# Altium project OksLab_CanToUsb_HW01.PrjPcb
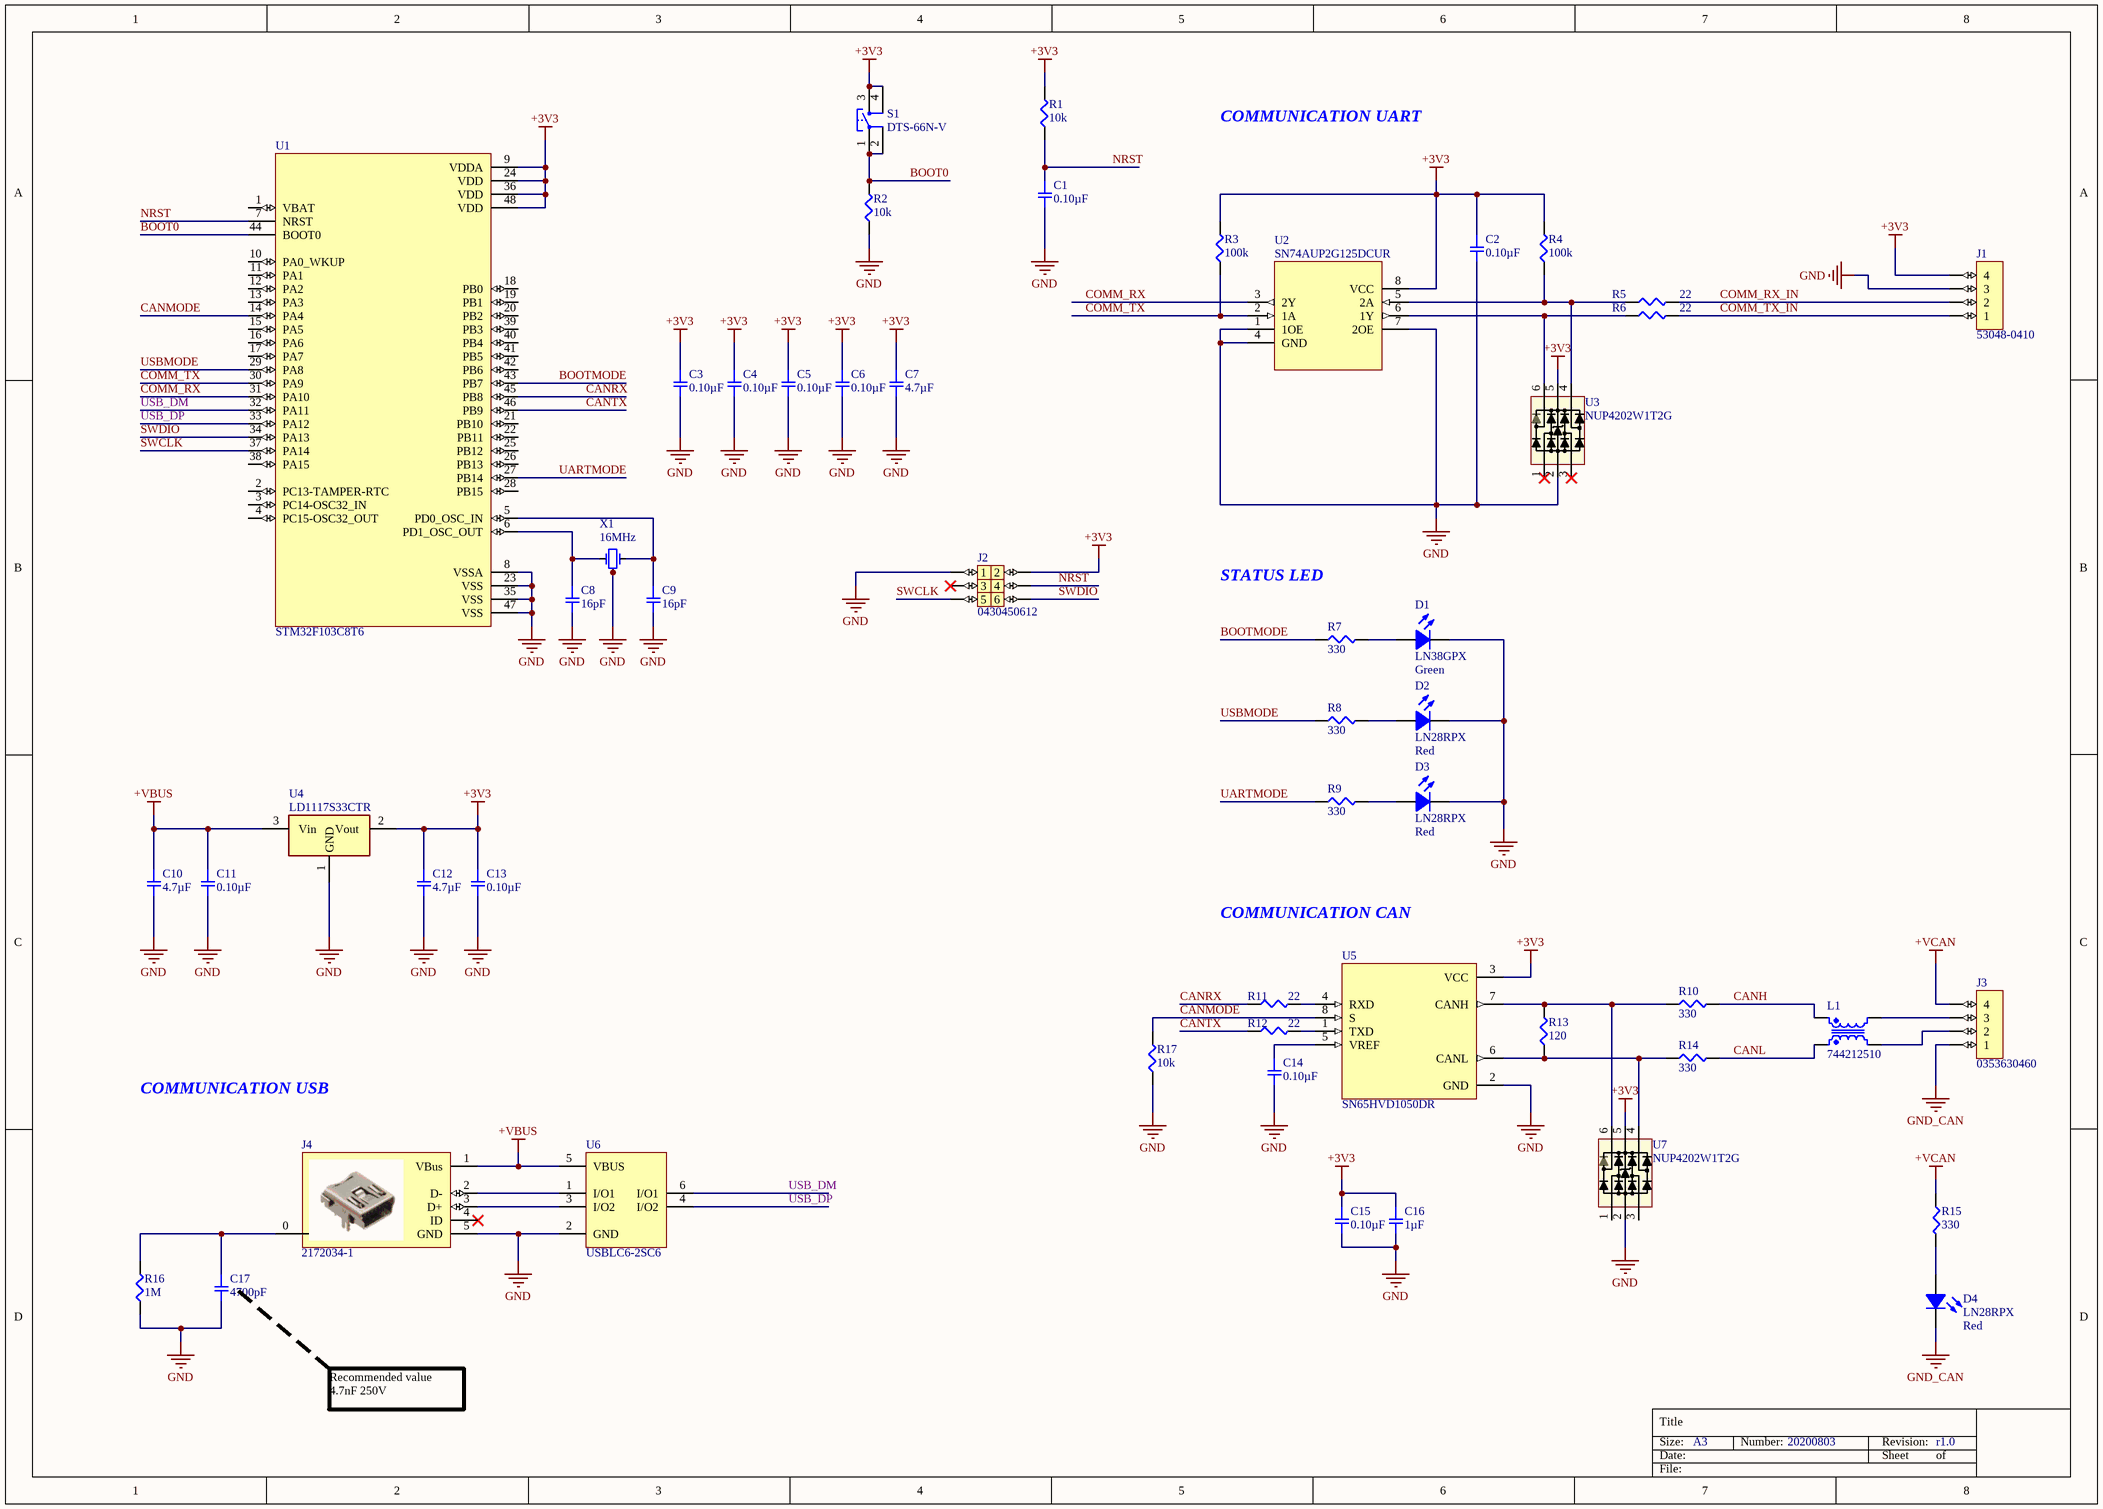
[diagram p0: OksLab_CanToUsb_HW01.SchDoc]
1 sheet, 52 parts. Net scope: global (net labels, ports and power ports of the same name join across sheets).
Board file: OksLab_CanToUsb_HW01.PcbDoc

## Sheet OksLab_CanToUsb_HW01.SchDoc
size A3; CompanyName: sinapstek; Engineer: yakdagg; SheetNumber: 1; SheetTotal: 1; UniqueID: 20200803; X1: OksLab_CanToUsb_HW01.PrjPcb; X2: A3; X3: 20200803; X4: r1.0; X6: 1; X7: 1; X8: OksLab_CanToUsb_HW01.SchDoc

### Parts
C1  0.10µF  [SMD-0603C]
C2  0.10µF  [SMD-0603C]
C3  0.10µF  [SMD-0603C]
C4  0.10µF  [SMD-0603C]
C5  0.10µF  [SMD-0603C]
C6  0.10µF  [SMD-0603C]
C7  4.7µF  [SMD-0603C]
C8  16pF  [SMD-0603C]
C9  16pF  [SMD-0603C]
C10  4.7µF  [SMD-0603C]
C11  0.10µF  [SMD-0603C]
C12  4.7µF  [SMD-0603C]
C13  0.10µF  [SMD-0603C]
C14  0.10µF  [SMD-0603C]
C15  0.10µF  [SMD-0603C]
C16  1µF  [SMD-0603C]
C17  4700pF  [SMD-0805C]
D1  LN38GPX  Color: Green  [Led-3mm-Green-h7]
D2  LN28RPX  Lens Color: Red  [Led-3mm-Red-h7]
D3  LN28RPX  Lens Color: Red  [Led-3mm-Red-h7]
D4  LN28RPX  Lens Color: Red  [Led-3mm-Red-h7]
J1  53048-0410  [CONN_4_POS__0530480410]
J2  0430450612  [CONN_6_POS__0430450612]
J3  0353630460  [CONN_4_POS__0353630460]
J4  2172034-1  [USB_MINI__2172034-1]
L1  744212510  [CM_6.50mm x 3.60mm]
R1  10k  [SMD-0603-RES]
R2  10k  [SMD-0603-RES]
R3  100k  [SMD-0603-RES]
R4  100k  [SMD-0603-RES]
R5  22  [SMD-0603-RES]
R6  22  [SMD-0603-RES]
R7  330  [SMD-0603-RES]
R8  330  [SMD-0603-RES]
R9  330  [SMD-0603-RES]
R10  330  [SMD-0603-RES]
R11  22  [SMD-0603-RES]
R12  22  [SMD-0603-RES]
R13  120  [SMD-0603-RES]
R14  330  [SMD-0603-RES]
R15  330  [SMD-0603-RES]
R16  1M  [SMD-0603-RES]
R17  10k  [SMD-0603-RES]
S1  DTS-66N-V  [Tact_THD_6x6_13mm]
U1  STM32F103C8T6  [QFN48-(7mmX7mm)]
U2  SN74AUP2G125DCUR  [VFSOP_8]
U3  NUP4202W1T2G  [SOT-363]
U4  LD1117S33CTR  [SOT223-3N]
U5  SN65HVD1050DR  [SOIC-8_L]
U6  USBLC6-2SC6  [SOT23-6]
U7  NUP4202W1T2G  [SOT-363]
X1  Frequency: 16MHz  [XTAL_3.2mm_2.5mm_4pad]  (hidden comment: 7M-16.000MAAJ-T)

### Nets
+3V3: C2.1 C3.1 C4.1 C5.1 C6.1 C7.1 C12.1 C13.1 C15.1 C16.1 J1.4 J2.2 R1.2 R3.2 R4.2 S1.3 S1.4 U1.9(VDDA) U1.24(VDD) U1.36(VDD) U1.48(VDD) U2.8(VCC) U3.5 U4.2(Vout) U5.3(VCC) U7.5
+VBUS: C10.1 C11.1 J4.1(VBus) U4.3(Vin) U6.5(VBUS)
+VCAN: J3.4 R15.1
GND: C1.2 C2.2 C3.2 C4.2 C5.2 C6.2 C7.2 C8.2 C9.2 C10.2 C11.2 C12.2 C13.2 C14.2 C15.2 C16.2 C17.2 D1.2(K) D2.2(K) D3.2(K) J1.3 J2.1 J4.5(GND) R2.1 R16.1 R17.1 U1.8(VSSA) U1.23(VSS) U1.35(VSS) U1.47(VSS) U2.1(1OE) U2.4(GND) U2.7(2OE) U3.2 U4.1(GND) U5.2(GND) U6.2(GND) U7.2 X1.2(GND) X1.4(GND)
GND_CAN: D4.2(K) J3.1
BOOT0: R2.2 S1.1 S1.2 U1.44(BOOT0)
BOOTMODE: R7.1 U1.43(PB7)
CANH: L1.3 R10.2
CANL: L1.1 R14.2
CANMODE: R17.2 U1.14(PA4) U5.8(S)
CANRX: R11.1 U1.45(PB8)
CANTX: R12.1 U1.46(PB9)
COMM_RX: U1.31(PA10) U2.3(2Y)
COMM_RX_IN: J1.2 R5.2
COMM_TX: R3.1 U1.30(PA9) U2.2(1A)
COMM_TX_IN: J1.1 R6.2
NRST: C1.1 J2.4 R1.1 U1.7(NRST)
SWCLK: J2.5 U1.37(PA14)
SWDIO: J2.6 U1.34(PA13)
UARTMODE: R9.1 U1.27(PB14)
USB_DM: U1.32(PA11) U6.6(I/O1)
USB_DP: U1.33(PA12) U6.4(I/O2)
USBMODE: R8.1 U1.29(PA8)
NetC8_1: C8.1 U1.6(PD1_OSC_OUT) X1.1(OSC1)
NetC9_1: C9.1 U1.5(PD0_OSC_IN) X1.3(OSC2)
NetC14_1: C14.1 U5.5(VREF)
NetC17_1: C17.1 J4.0(Shield) R16.2
NetD1_1: D1.1(A) R7.2
NetD2_1: D2.1(A) R8.2
NetD3_1: D3.1(A) R9.2
NetD4_1: D4.1(A) R15.2
NetJ3_2: J3.2 L1.5
NetJ3_3: J3.3 L1.4
NetJ4_2: J4.2(D-) U6.1(I/O1)
NetJ4_3: J4.3(D+) U6.3(I/O2)
NetR4_1: R4.1 R5.1 U2.5(2A) U3.4
NetR6_1: R6.1 U2.6(1Y) U3.6
NetR10_1: R10.1 R13.2 U5.7(CANH) U7.6
NetR11_2: R11.2 U5.4(RXD)
NetR12_2: R12.2 U5.1(TXD)
NetR13_1: R13.1 R14.1 U5.6(CANL) U7.4

Not connected (* = marked no-connect by the designer): J2 3*; J4 4(ID)*; U1 1(VBAT) 2(PC13-TAMPER-RTC) 3(PC14-OSC32_IN) 4(PC15-OSC32_OUT) 10(PA0_WKUP) 11(PA1) 12(PA2) 13(PA3) 15(PA5) 16(PA6) 17(PA7) 18(PB0) 19(PB1) 20(PB2) 21(PB10) 22(PB11) 25(PB12) 26(PB13) 28(PB15) 38(PA15) 39(PB3) 40(PB4) 41(PB5) 42(PB6); U3 1* 3*; U7 1 3

### Notes on the sheet
- COMMUNICATION UART
- STATUS LED
- COMMUNICATION CAN
- COMMUNICATION USB
- Recommended value
  4.7nF 250V
- Title
- Size:
- Date:
- Number:
- Revision:
- Sheet
- of
- File:

### Library data of the parts
C1-C6 C11 C13-C15 = GCJ188R71H104KA12D: CAP CER 0.1UF 50V X7R 0603; Manufacturer: Murata Electronics North America; Factory Stock: 0; Unit Price (USD): 0.12; Minimum Quantity: 1; Tolerance: ±10%; Datasheets: http://www.murata.com/~/media/webrenewal/support/library/catalog/products/capacitor/mlcc/c03e.ashx; Image: //media.digikey.com/Renders/Murata%20Renders/0603%28LQG18%29.jpg; Digi-Key Part Number: 490-5798-1-ND; Quantity Available: 163695; @ qty: 0; Packaging: Cut Tape (CT); Series: GCJ; Part Status: Active; Value: 0.10µF; Voltage: 50V; Temperature Coefficient: X7R; Operating Temperature: -55°C ~ 125°C; Features: Soft Termination; Ratings: AEC-Q200; Applications: Automotive, Boardflex Sensitive; Mounting Type: Surface Mount, MLCC; Package / Case: 0603 (1608 Metric); Size / Dimension: 0.063" L x 0.031" W (1.60mm x 0.80mm); Height - Seated (Max): -; Thickness (Max): 0.035" (0.90mm); Lead Spacing: -; Lead Style: -
  C1 C3-C6 C11 C13-C15: Part Number: GCJ188R71H104KA12D
  C2: Manufacturer Part Number: GCJ188R71H104KA12D
C7 C10 C12 = GRM188R61C475KAAJD: CAP CER 4.7UF 16V X5R 0603; Manufacturer: Murata Electronics North America; Factory Stock: 0; Unit Price (USD): 0.3; Minimum Quantity: 1; Tolerance: ±10%; Datasheets: http://www.murata.com/~/media/webrenewal/support/library/catalog/products/capacitor/mlcc/c02e.pdf; Image: //media.digikey.com/Renders/Murata%20Renders/ZRB-SERIES-0402.jpg; Digi-Key Part Number: 490-10481-1-ND; Part Number: GRM188R61C475KAAJD; Quantity Available: 5977; @ qty: 0; Packaging: Cut Tape (CT); Series: GRM; Part Status: Active; Value: 4.7µF; Voltage: 16V; Temperature Coefficient: X5R; Operating Temperature: -55°C ~ 85°C; Features: Derating Recommended; Ratings: -; Applications: General Purpose; Mounting Type: Surface Mount, MLCC; Package / Case: 0603 (1608 Metric); Size / Dimension: 0.063" L x 0.031" W (1.60mm x 0.80mm); Height - Seated (Max): -; Thickness (Max): 0.037" (0.95mm); Lead Spacing: -; Lead Style: -
C8 C9 = GCM1885C1H160JA16D: CAP CER 16PF 50V NP0 0603; Manufacturer: Murata Electronics North America; Factory Stock: 0; Unit Price (USD): 0.11; Minimum Quantity: 1; Tolerance: ±5%; Temperature Coefficient: C0G, NP0; Datasheets: http://www.murata.com/~/media/webrenewal/support/library/catalog/products/capacitor/mlcc/c03e.ashx; Image: //media.digikey.com/Renders/Murata%20Renders/0603%28GCM188%29.jpg; Digi-Key Part Number: 490-8003-1-ND; Part Number: GCM1885C1H160JA16D; Quantity Available: 25223; @ qty: 0; Packaging: Cut Tape (CT); Series: GCM; Part Status: Active; Value: 16pF; Voltage: 50V; Operating Temperature: -55°C ~ 125°C; Features: -; Ratings: AEC-Q200; Applications: Automotive; Mounting Type: Surface Mount, MLCC; Package / Case: 0603 (1608 Metric); Size / Dimension: 0.063" L x 0.031" W (1.60mm x 0.80mm); Height - Seated (Max): -; Thickness (Max): 0.035" (0.90mm); Lead Spacing: -; Lead Style: -
C16 = GCM188R71C105KA64D: CAP CER 1UF 16V X7R 0603; Manufacturer: Murata Electronics North America; Factory Stock: 0; Unit Price (USD): 0.24; Minimum Quantity: 1; Tolerance: ±10%; Datasheets: http://www.murata.com/~/media/webrenewal/support/library/catalog/products/capacitor/mlcc/c03e.ashx; Image: //media.digikey.com/Renders/Murata%20Renders/0603%28GCM188%29.jpg; Digi-Key Part Number: 490-5241-1-ND; Part Number: GCM188R71C105KA64D; Quantity Available: 9243; @ qty: 0; Packaging: Cut Tape (CT); Series: GCM; Part Status: Active; Value: 1µF; Voltage: 16V; Temperature Coefficient: X7R; Operating Temperature: -55°C ~ 125°C; Features: -; Ratings: AEC-Q200; Applications: Automotive; Mounting Type: Surface Mount, MLCC; Package / Case: 0603 (1608 Metric); Size / Dimension: 0.063" L x 0.031" W (1.60mm x 0.80mm); Height - Seated (Max): -; Thickness (Max): 0.035" (0.90mm); Lead Spacing: -; Lead Style: -
C17 = GRM21AR72E472KW01D: CAP CER 4700PF 250V X7R 0805; Manufacturer: Murata Electronics North America; Factory Stock: 0; Unit Price (USD): 0.12; Minimum Quantity: 1; Tolerance: ±10%; Datasheets: http://www.murata.com/~/media/webrenewal/support/library/catalog/products/capacitor/mlcc/c02e.pdf; Image: //media.digikey.com/Renders/Murata%20Renders/0805%20(2012%20Metric)%20.85mm.jpg; Digi-Key Part Number: 490-3532-1-ND; Quantity Available: 18270; @ qty: 0; Packaging: Cut Tape (CT); Series: GRM; Part Status: Active; Value: 4700pF; Voltage: 250V; Temperature Coefficient: X7R; Operating Temperature: -55°C ~ 125°C; Features: -; Ratings: -; Applications: General Purpose; Mounting Type: Surface Mount, MLCC; Package / Case: 0805 (2012 Metric); Size / Dimension: 0.079" L x 0.049" W (2.00mm x 1.25mm); Height - Seated (Max): -; Thickness (Max): 0.039" (1.00mm); Lead Spacing: -; Lead Style: -; Manufacturer Part Number: GRM21AR72E472KW01D
D1 = LED_GREEN__LN38GPX: LED GREEN 3MM ROUND T/H; Manufacturer: Panasonic Electronic Components; Configuration: Standard; Millicandela Rating: 6mcd; Lens Style: Round with Domed Top; Lens Size: 3mm, T-1; Voltage - Forward (Vf) (Typ): 2.2V; Current - Test: 20mA; Wavelength - Peak: 565nm; Supplier 1: Digi-Key; Manufacturer Part Number: LN38GPX; RoHS: RoHS Compliant; Category: Optoelectronics; Stock 1: 0; Pricing 1: 1400=0 (USD); Packaging: Bulk; Part Status: Obsolete; Lens Color: -; Lens Transparency: -; Viewing Angle: -; Mounting Type: Through Hole; Wavelength - Dominant: -; Features: -; Package / Case: Radial; Supplier Device Package: Round Type; Size / Dimension: -; Height (Max): 5.70mm; Base Part Number: LN*8; ComponentLink1URL: https://media.digikey.com/pdf/Data%20Sheets/Panasonic%20LEDs%20PDFs/LN38GPX_Rev_Mar_2012.pdf; ComponentLink1Description: https://media.digikey.com/pdf/Data%20Sheets/Panasonic%20LEDs%20PDFs/LN38GPX_Rev_Mar_2012.pdf; Supplier Part Number 1: P564-ND
D2-D4 = LED_RED__LN28RPX: LED RED DIFF 3MM ROUND T/H; Manufacturer: Panasonic Electronic Components; Lens Transparency: Diffused; Millicandela Rating: 2.8mcd; Lens Style/Size: Round with Domed Top, 3mm (T-1), 3.00mm; Voltage - Forward (Vf) (Typ): 2.2V; Current - Test: 15mA; Wavelength - Peak: 700nm; Manufacturer Part Number: LN28RPX; Category: Optoelectronics; Supplier: Digi-Key; RoHS: RoHS Compliant; Packaging: Bulk; Part Status: Not For New Designs; Color: Red; Viewing Angle: -; Mounting Type: Through Hole; Wavelength - Dominant: -; Features: -; Package / Case: Radial; Supplier Device Package: 3mm Round; Size / Dimension: -; Height (Max): 5.70mm; ComponentLink1URL: http://industrial.panasonic.com/www-cgi/jvcr13pz.cgi?E+SC+4+ATA7001+LN28RPX+8+WW; ComponentLink1Description: http://industrial.panasonic.com/www-cgi/jvcr13pz.cgi?E+SC+4+ATA7001+LN28RPX+8+WW; Pricing: 1=0.45, 10=0.326, 25=0.2664, 100=0.213, 250=0.17972, 500=0.15308, 1000=0.11981, 2500=0.10982, 5000=0.09984 (USD); Supplier Part Number: P563-ND
J1 = CONN_4_POS__0530480410: CONN HEADER R/A 4POS 1.25MM; Manufacturer: Molex; Contact Resistance: 20mR; Current Rating: 1A; Voltage Rating: 125V; Number of Positions: 4; Insulation Resistance: 100MR; Gender: Male; Connector Type: Blade Pin; Glow Wire Compliant: Non-compliant; Supplier 1: Avnet; Manufacturer Part Number: 53048-0410; Stock 1: 44; Pricing 1: 1=0.1232 (USD); Mount: Through Hole; Case/Package: 0410; Contact Material: Bronze,Tin; Contact Plating: Tin; Color: Natural; Housing Color: Natural; Housing Material: Nylon; Min Operating Temperature: -40°C; Max Operating Temperature: 85°C; Package Quantity: 5000; Number of Rows: 1; Packaging: Tray; Contact Gender: Male; Termination: Solder; Number of Contacts: 4; Orientation: Right Angle; Number of Circuits: 4; Voltage Rating (DC): 125V; Series: PicoBlade; Contact Type: Blade Pin; Pitch: 1.25mm; Depth: 5.5mm; Radiation Hardening: No; REACH SVHC: Unknown; Lead Free: Lead Free; Flammability Rating: UL94 V-0; RoHS Compliant: Yes; ComponentLink1URL: https://www.distrelec.biz/Web/Downloads/60/_e/gg116847-116860_e.pdf?mime=application%2Fpdf&src-supplier=Distrelec; ComponentLink1Description: https://www.distrelec.biz/Web/Downloads/60/_e/gg116847-116860_e.pdf?mime=application%2Fpdf&src-supplier=Distrelec; ComponentLink2URL: http://uk.rs-online.com/webdocs/1362/0900766b81362ba7.pdf?src-supplier=RSComponents; ComponentLink2Description: http://uk.rs-online.com/webdocs/1362/0900766b81362ba7.pdf?src-supplier=RSComponents; ComponentLink3URL: http://www.molex.com/webdocs/datasheets/pdf/en-us/0530480410_PCB_HEADERS.pdf?src-supplier=Avnet; ComponentLink3Description: http://www.molex.com/webdocs/datasheets/pdf/en-us/0530480410_PCB_HEADERS.pdf?src-supplier=Avnet; ComponentLink4URL: http://www.mouser.com/ds/2/276/0530480410_PCB_HEADERS-170930.pdf?src-supplier=Mouser; ComponentLink4Description: http://www.mouser.com/ds/2/276/0530480410_PCB_HEADERS-170930.pdf?src-supplier=Mouser; Supplier Part Number 1: 53048-0410
J2 = CONN_6_POS__0430450612: CONN HEADER 6POS 3MM VERT TIN; Manufacturer: Molex, LLC; Pitch - Mating: 0.118" (3.00mm); Shrouding: Shrouded - 4 Wall; Number of Positions: 6; Style: Board to Cable/Wire; Number of Positions Loaded: All; Contact Length - Post: 0.125" (3.18mm); Material Flammability Rating: UL94 V-0; Ingress Protection: -; Connector Type: Header; Contact Finish - Mating: Tin; RoHS: RoHS Compliant; Contact Length - Mating: -; Part Status: Active; Current Rating: -; Contact Finish - Post: Tin; Contact Material: Brass; Row Spacing - Mating: 0.118" (3.00mm); Packaging: Tray; Operating Temperature: -; Overall Contact Length: -; Insulation Material: Liquid Crystal Polymer (LCP), Glass Filled; Termination: Kinked Pin, Solder; Features: Board Guide; Contact Shape: Square; Number of Rows: 2; Contact Finish Thickness - Mating: 100µin (2.54µm); Contact Type: Male Pin; Voltage Rating: -; Applications: General Purpose, Medical, Military, Telecommunications; Contact Finish Thickness - Post: -; Insulation Color: Black; Mated Stacking Heights: -; Fastening Type: Locking Ramp; Insulation Height: 0.390" (9.91mm); Manufacturer Part Number: 0430450612; Mounting Type: Through Hole; Category: Connectors, Interconnects; Supplier: Digi-Key; ComponentLink1URL: http://www.molex.com/pdm_docs/sd/430450612_sd.pdf; ComponentLink1Description: http://www.molex.com/pdm_docs/sd/430450612_sd.pdf; Pricing: 1=1.36, 10=1.232, 50=1.106, 100=1.0557, 250=0.95512, 500=0.87972, 1000=0.75405, 2500=0.70378, 5000=0.66859 (USD); Supplier Part Number: WM1791-ND
J3 = CONN_4_POS__0353630460: CONN HEADER 4POS 2MM R/A TIN; Manufacturer: Molex Connector Corporation; Shrouding: Shrouded - 4 Wall; Style: Board to Cable/Wire; Pitch - Mating: 0.079" (2.00mm); Material Flammability Rating: UL94 V-0; Contact Length - Mating: 0.145" (3.70mm); Contact Length - Post: 0.126" (3.20mm); Number of Positions Loaded: All; Number of Positions: 4; Insulation Color: Natural; Insulation Material: Polyamide (PA), Nylon; Contact Finish Thickness - Mating: 78.7µin (2.00µm); Insulation Height: 0.217" (5.51mm); Overall Contact Length: -; Part Status: Active; Current Rating: -; RoHS: RoHS Compliant; Ingress Protection: -; Contact Material: Brass; Contact Finish - Post: Tin; Termination: Kinked Pin, Solder; Mounting Type: Through Hole, Right Angle; Fastening Type: Locking Ramp; Row Spacing - Mating: -; Mated Stacking Heights: -; Features: -; Contact Shape: Square; Contact Type: Male Pin; Packaging: Bulk; Supplier: Digi-Key; Manufacturer Part Number: 0353630460; Category: Connectors, Interconnects; Contact Finish Thickness - Post: 78.7µin (2.00µm); Voltage Rating: -; Operating Temperature: -; Contact Finish - Mating: Tin; Number of Rows: 1; Connector Type: Header; Applications: Automotive, General Purpose; ComponentLink1URL: http://www.molex.com/pdm_docs/sd/353630460_sd.pdf; ComponentLink1Description: http://www.molex.com/pdm_docs/sd/353630460_sd.pdf; Pricing: 1=0.48, 10=0.455, 100=0.3184, 500=0.27294, 1000=0.22745, 5000=0.19496, 10000=0.18196 (USD); Supplier Part Number: WM18933-ND
J4 = USB_MINI__2172034-1: CONN RCPT USB2.0 MINI B 5P R/A; Manufacturer: TE Connectivity AMP; Plating: Nickel; Gender: Female; Connector Type: Receptacle; Number of Ports: 1; Number of Positions: 5; Plating Thickness: 0.762um; PCB Thickness: 1.6mm; Tail Length: 2.84mm; Supplier 1: Avnet; Manufacturer Part Number: 2172034-1; Stock 1: 0; Pricing 1: 13110=0.5326, 26220=0.5141, 52440=0.4965, 78660=0.4789, 104880=0.4613, 131100=0.4437, 1311000=0.4261 (USD); Housing Color: Black; Contact Plating: Gold; Housing Material: PBT; Packaging: Tray; Termination: Through Hole; Orientation: Right Angle; Package Quantity: 95; ELV: Compliant; RoHS Compliant: Yes; ComponentLink1URL: http://www.te.com/commerce/DocumentDelivery/DDEController?Action=srchrtrv&DocNm=2172034&DocType=Customer+Drawing&DocLang=English&src-supplier=Digi-Key; ComponentLink1Description: http://www.te.com/commerce/DocumentDelivery/DDEController?Action=srchrtrv&DocNm=2172034&DocType=Customer+Drawing&DocLang=English&src-supplier=Digi-Key; ComponentLink2URL: http://www.mouser.com/ds/2/418/NG_CD_2172034_A-624684.pdf?src-supplier=Mouser; ComponentLink2Description: http://www.mouser.com/ds/2/418/NG_CD_2172034_A-624684.pdf?src-supplier=Mouser; ComponentLink3URL: https://www.te.com/commerce/DocumentDelivery/DDEController?Action=srchrtrv&DocNm=2172034&DocType=Customer+Drawing&DocLang=English&src-supplier=Digi-Key; ComponentLink3Description: https://www.te.com/commerce/DocumentDelivery/DDEController?Action=srchrtrv&DocNm=2172034&DocType=Customer+Drawing&DocLang=English&src-supplier=Digi-Key; Supplier Part Number 1: 2172034-1
L1 = CM__744212510: Common Mode Filters / Chokes WE-SL1 SMD Ln Filter 2x51uH 300ohm; Manufacturer: Wurth Electronics; Core Material: Ferrite; Inductance: 51uH; Number of Lines: 2; DC Resistance (DCR): 160mR; Current Rating: 300mA; Test Frequency: 100kHz; Inductance Tolerance: 50%; Voltage Rating (DC): 80V; Impedance: 300R; Supplier 1: Digi-Key; Manufacturer Part Number: 744212510; RoHS: Yes; Category: Fixed Inductors; Pricing 1: 1=4,37000, 10=4,31200, 50=3,89500, 100=3,75600, 500=3,47800 (USD); Mount: Surface Mount; Case/Package: SMD/SMT; Number of Pins: 4; Min Operating Temperature: -40°C; Max Operating Temperature: 105°C; Package Quantity: 1000; Packaging: Tape and Reel; Current: 300mA; Max DC Current: 300mA; Termination: SMD/SMT; Series: WE-SL1; Tolerance: 50%; Length: 6.5mm; Width: 0.142inch; Height: 1.65mm; Depth: 3.6mm; REACH SVHC: No SVHC; Lead Free: Lead Free; RoHS Compliant: Yes; ComponentLink1URL: https://datasheet.ciiva.com/11800/0900766b8059564e-11800467.pdf?src-supplier=RSComponents; ComponentLink1Description: https://datasheet.ciiva.com/11800/0900766b8059564e-11800467.pdf?src-supplier=RSComponents; ComponentLink2URL: https://datasheet.ciiva.com/6048/1735560-6048484.pdf?src-supplier=Farnell; ComponentLink2Description: https://datasheet.ciiva.com/6048/1735560-6048484.pdf?src-supplier=Farnell; ComponentLink3URL: https://datasheet.ciiva.com/1130/744212510-1130407.pdf?src-supplier=Newark; ComponentLink3Description: https://datasheet.ciiva.com/1130/744212510-1130407.pdf?src-supplier=Newark; ComponentLink4URL: https://datasheet.ciiva.com/4952/744212510-77598-4952687.pdf?src-supplier=Mouser; ComponentLink4Description: https://datasheet.ciiva.com/4952/744212510-77598-4952687.pdf?src-supplier=Mouser; ComponentLink5URL: https://datasheet.ciiva.com/7764/1735560-7764951.pdf?src-supplier=Element14; ComponentLink5Description: https://datasheet.ciiva.com/7764/1735560-7764951.pdf?src-supplier=Element14; ComponentLink6URL: https://datasheet.ciiva.com/6216/744212510-6216346.pdf?src-supplier=Digi-Key; ComponentLink6Description: https://datasheet.ciiva.com/6216/744212510-6216346.pdf?src-supplier=Digi-Key; ComponentLink7URL: https://datasheet.ciiva.com/22705/1735560-22705131.pdf?src-supplier=Element14; ComponentLink7Description: https://datasheet.ciiva.com/22705/1735560-22705131.pdf?src-supplier=Element14; ComponentLink8URL: https://datasheet.ciiva.com/6216/744212510-6216348.pdf?src-supplier=Digi-Key; ComponentLink8Description: https://datasheet.ciiva.com/6216/744212510-6216348.pdf?src-supplier=Digi-Key; Supplier Part Number 1: 732-3941-6-ND
R1 R2 R17 = ERJ-3EKF1002V: RES SMD 10K OHM 1% 1/10W 0603; Manufacturer: Panasonic Electronic Components; Factory Stock: 0; Unit Price (USD): 0.00379; @ qty: 1500; Minimum Quantity: 1; Power (Watts): 0.1W, 1/10W; Temperature Coefficient: ±100ppm/°C; Part Number: ERJ-3EKF1002V; Datasheets: http://industrial.panasonic.com/www-cgi/jvcr13pz.cgi?E+PZ+3+AOA0002+ERJ3EKF1002V+7+WW; Image: //media.digikey.com/Photos/Panasonic%20Photos/MFG_ERJ-P6W%20Series.jpg; Digi-Key Part Number: P10.0KHCT-ND; Quantity Available: 6703141; Packaging: Cut Tape (CT); Series: ERJ; Part Status: Active; Value: 10k; Tolerance: ±1%; Composition: Thick Film; Features: Automotive AEC-Q200; Operating Temperature: -55°C ~ 155°C; Package / Case: 0603 (1608 Metric); Supplier Device Package: 0603; Size / Dimension: 0.063" L x 0.031" W (1.60mm x 0.80mm); Height - Seated (Max): 0.022" (0.55mm); Number of Terminations: 2; Failure Rate: -
R3 R4 = ERJ-3EKF1003V: RES SMD 100K OHM 1% 1/10W 0603; Manufacturer: Panasonic Electronic Components; Factory Stock: 0; Unit Price (USD): 0.00379; @ qty: 1500; Minimum Quantity: 1; Power (Watts): 0.1W, 1/10W; Temperature Coefficient: ±100ppm/°C; Part Number: ERJ-3EKF1003V; Datasheets: http://industrial.panasonic.com/www-cgi/jvcr13pz.cgi?E+PZ+3+AOA0002+ERJ3EKF1003V+7+WW; Image: //media.digikey.com/Photos/Panasonic%20Photos/MFG_ERJ-P6W%20Series.jpg; Digi-Key Part Number: P100KHCT-ND; Quantity Available: 2179804; Packaging: Cut Tape (CT); Series: ERJ; Part Status: Active; Value: 100k; Tolerance: ±1%; Composition: Thick Film; Features: Automotive AEC-Q200; Operating Temperature: -55°C ~ 155°C; Package / Case: 0603 (1608 Metric); Supplier Device Package: 0603; Size / Dimension: 0.063" L x 0.031" W (1.60mm x 0.80mm); Height - Seated (Max): 0.022" (0.55mm); Number of Terminations: 2; Failure Rate: -
R5 R6 R11 R12 = ERJ-3EKF22R0V: RES SMD 22 OHM 1% 1/10W 0603; Manufacturer: Panasonic Electronic Components; Factory Stock: 0; Unit Price (USD): 0.00379; @ qty: 1500; Minimum Quantity: 1; Power (Watts): 0.1W, 1/10W; Temperature Coefficient: ±100ppm/°C; Part Number: ERJ-3EKF22R0V; Datasheets: http://industrial.panasonic.com/www-cgi/jvcr13pz.cgi?E+PZ+3+AOA0002+ERJ3EKF22R0V+7+WW; Image: //media.digikey.com/Photos/Panasonic%20Photos/MFG_ERJ-P6W%20Series.jpg; Digi-Key Part Number: P22.0HCT-ND; Quantity Available: 100321; Packaging: Cut Tape (CT); Series: ERJ; Part Status: Active; Value: 22; Tolerance: ±1%; Composition: Thick Film; Features: Automotive AEC-Q200; Operating Temperature: -55°C ~ 155°C; Package / Case: 0603 (1608 Metric); Supplier Device Package: 0603; Size / Dimension: 0.063" L x 0.031" W (1.60mm x 0.80mm); Height - Seated (Max): 0.022" (0.55mm); Number of Terminations: 2; Failure Rate: -
R7-R10 R14 R15 = ERJ-3EKF3300V: RES SMD 330 OHM 1% 1/10W 0603; Manufacturer: Panasonic Electronic Components; Factory Stock: 0; Unit Price (USD): 0.00379; @ qty: 1500; Minimum Quantity: 1; Power (Watts): 0.1W, 1/10W; Temperature Coefficient: ±100ppm/°C; Part Number: ERJ-3EKF3300V; Datasheets: http://industrial.panasonic.com/www-cgi/jvcr13pz.cgi?E+PZ+3+AOA0002+ERJ3EKF3300V+7+WW; Image: //media.digikey.com/Photos/Panasonic%20Photos/MFG_ERJ-P6W%20Series.jpg; Digi-Key Part Number: P330HCT-ND; Quantity Available: 670984; Packaging: Cut Tape (CT); Series: ERJ; Part Status: Active; Value: 330; Tolerance: ±1%; Composition: Thick Film; Features: Automotive AEC-Q200; Operating Temperature: -55°C ~ 155°C; Package / Case: 0603 (1608 Metric); Supplier Device Package: 0603; Size / Dimension: 0.063" L x 0.031" W (1.60mm x 0.80mm); Height - Seated (Max): 0.022" (0.55mm); Number of Terminations: 2; Failure Rate: -
R13 = ERJ-3EKF1200V: RES SMD 120 OHM 1% 1/10W 0603; Manufacturer: Panasonic Electronic Components; Factory Stock: 0; Unit Price (USD): 0.00379; @ qty: 1500; Minimum Quantity: 1; Power (Watts): 0.1W, 1/10W; Temperature Coefficient: ±100ppm/°C; Part Number: ERJ-3EKF1200V; Datasheets: http://industrial.panasonic.com/www-cgi/jvcr13pz.cgi?E+PZ+3+AOA0002+ERJ3EKF1200V+7+WW; Image: //media.digikey.com/Photos/Panasonic%20Photos/MFG_ERJ-P6W%20Series.jpg; Digi-Key Part Number: P120HCT-ND; Quantity Available: 84623; Packaging: Cut Tape (CT); Series: ERJ; Part Status: Active; Value: 120; Tolerance: ±1%; Composition: Thick Film; Features: Automotive AEC-Q200; Operating Temperature: -55°C ~ 155°C; Package / Case: 0603 (1608 Metric); Supplier Device Package: 0603; Size / Dimension: 0.063" L x 0.031" W (1.60mm x 0.80mm); Height - Seated (Max): 0.022" (0.55mm); Number of Terminations: 2; Failure Rate: -
R16 = ERJ-3EKF1004V: RES SMD 1M OHM 1% 1/10W 0603; Manufacturer: Panasonic Electronic Components; Factory Stock: 0; Unit Price (USD): 0.00379; @ qty: 1500; Minimum Quantity: 1; Power (Watts): 0.1W, 1/10W; Temperature Coefficient: ±100ppm/°C; Datasheets: http://industrial.panasonic.com/www-cgi/jvcr13pz.cgi?E+PZ+3+AOA0002+ERJ3EKF1004V+7+WW; Image: //media.digikey.com/Photos/Panasonic%20Photos/MFG_ERJ-P6W%20Series.jpg; Digi-Key Part Number: P1.00MHCT-ND; Quantity Available: 1632074; Packaging: Cut Tape (CT); Series: ERJ; Part Status: Active; Value: 1M; Tolerance: ±1%; Composition: Thick Film; Features: Automotive AEC-Q200; Operating Temperature: -55°C ~ 155°C; Package / Case: 0603 (1608 Metric); Supplier Device Package: 0603; Size / Dimension: 0.063" L x 0.031" W (1.60mm x 0.80mm); Height - Seated (Max): 0.022" (0.55mm); Number of Terminations: 2; Failure Rate: -; Manufacturer Part Number: ERJ-3EKF1004V
S1 = SWITCH_TACTILE__DTS-66N-V: Tactile Switches 6x6mm 13mm 160gf BROWN; Manufacturer: Diptronics; Outline: 6.20x6.20; Manufacturer Part Number: DTS-66N-V; Actuator Height off PCB, Vertical: 13 mm
U1 = STM32F103C8T6: IC MCU 32-Bit 72MHz 64kB FLASH LQFP48; MF: STMicroelectronics; RAM Size: 20KB; Max Power Dissipation: 363mW; Interface: I2C,SPI,USB,CAN,IrDA,UART,USART,LIN; Number of I/Os: 37; Number of Timers/Counters: 4; Max Supply Voltage: 3.6V; Number of ADC Channels: 10; Min Supply Voltage: 2V; Oscillator Type: Internal; Number of Programmable I/O: 48; Data Bus Width: 32b; Number of Bits: 32; Watchdog Timer: Yes; Peripherals: POR,PWM,WDT,DMA,Temp Sensor,I2C; Core Architecture: ARM; Number of PWM Channels: 1; Number of SPI Channels: 2; Price: None; Package: LQFP-48 STMicroelectronics; Value: *; MP: STM32F103C8T6; Availability: Unavailable; Supplier 1: Digi-Key; Manufacturer: STMicroelectronics; Manufacturer Part Number: STM32F103C8T6; RoHS: Yes; Category: Microcontrollers; Pricing 1: 1=7,00000, 10=6,28800, 25=5,94440, 80=5,15175, 250=4,88756, 500=4,40320 (USD); Case/Package: LQFP; Number of Pins: 48; Min Operating Temperature: -40°C; Max Operating Temperature: 85°C; Frequency: 72MHz; Packaging: Tray; Package Quantity: 250; Density: 64KB; Memory Type: FLASH; Max Frequency: 72MHz; Memory Size: 64KB; Termination: SMD/SMT; Number of I2C Channels: 2; Address Bus Width: 32b; Length: 7mm; Width: 7.2mm; Height: 1.45mm; Radiation Hardening: No; Lead Free: Lead Free; REACH SVHC: No SVHC; ComponentLink1URL: https://datasheet.ciiva.com/15122/getdatasheetpartid-69880-15122076.pdf?src-supplier=Verical; ComponentLink1Description: https://datasheet.ciiva.com/15122/getdatasheetpartid-69880-15122076.pdf?src-supplier=Verical; ComponentLink2URL: https://datasheet.ciiva.com/26816/stm32f103c8t6-26816902.pdf?src-supplier=IIIC; ComponentLink2Description: https://datasheet.ciiva.com/26816/stm32f103c8t6-26816902.pdf?src-supplier=IIIC; ComponentLink3URL: https://datasheet.ciiva.com/16210/cd00161566-16210248.pdf?src-supplier=Future+Electronics; ComponentLink3Description: https://datasheet.ciiva.com/16210/cd00161566-16210248.pdf?src-supplier=Future+Electronics; ComponentLink4URL: https://datasheet.ciiva.com/14100/pustm-arm-microcont-stm32f103-en-14100508.pdf?src-supplier=Distrelec; ComponentLink4Description: https://datasheet.ciiva.com/14100/pustm-arm-microcont-stm32f103-en-14100508.pdf?src-supplier=Distrelec; ComponentLink5URL: https://datasheet.ciiva.com/8054/1730126-8054942.pdf?src-supplier=Element14; ComponentLink5Description: https://datasheet.ciiva.com/8054/1730126-8054942.pdf?src-supplier=Element14; ComponentLink6URL: https://datasheet.ciiva.com/48687/001075658-da-01-en-mcu-64kb-mem-stm32f103c8t6-lqfp-48-stm-48687589.pdf?src-supplier=Conrad; ComponentLink6Description: https://datasheet.ciiva.com/48687/001075658-da-01-en-mcu-64kb-mem-stm32f103c8t6-lqfp-48-stm-48687589.pdf?src-supplier=Conrad; Supplier Part Number 1: 497-6063-ND
U2 = SN74AUP2G125DCUR: Low-Power Dual Bus Buffer Gate With 3-State Outputs 8-VSSOP -40 to 85; Manufacturer: Texas Instruments; Max Supply Voltage: 3.6V; Min Supply Voltage: 800mV; Propagation Delay: 6.5ns; Number of Elements: 2; Logic Function: Buffer,Inverting; Low Level Output Current: 4mA; Number of Input Lines: 4; Polarity: Non-Inverting; Number of Bits per Element: 1; High Level Output Current: -4mA; Quiescent Current: 500nA; Supplier 1: Avnet; Manufacturer Part Number: SN74AUP2G125DCUR; Stock 1: 0; Mount: Surface Mount; Case/Package: VSSOP; Number of Pins: 8; Min Operating Temperature: -40°C; Max Operating Temperature: 85°C; Package Quantity: 3000; Packaging: Tape and Reel; Number of Channels: 2; Number of Inputs: 2; Number of Outputs: 2; Number of Output Lines: 4; Number of Bits: 2; Output Type: 3-STATE; Series: 74AUP; Technology: CMOS; Lead Free: Lead Free; RoHS Compliant: Yes; ComponentLink1URL: http://www.ti.com/lit/ds/symlink/sn74aup2g125.pdf?src-supplier=Digi-Key; ComponentLink1Description: http://www.ti.com/lit/ds/symlink/sn74aup2g125.pdf?src-supplier=Digi-Key; ComponentLink2URL: http://www.ti.com/general/docs/lit/getliterature.tsp?genericPartNumber=SN74AUP2G125&&fileType=pdf&src-supplier=Avnet; ComponentLink2Description: http://www.ti.com/general/docs/lit/getliterature.tsp?genericPartNumber=SN74AUP2G125&&fileType=pdf&src-supplier=Avnet; Supplier Part Number 1: SN74AUP2G125DCUR
U3 U7 = NUP4202W1T2G: TVS DIODE 5VWM 14.5VC SOT363; Manufacturer: ON Semiconductor; Capacitance @ Frequency: 3pF @ 1MHz; Voltage - Reverse Standoff (Typ): 5V (Max); Voltage - Breakdown (Min): 6V; Power Line Protection: No; Current - Peak Pulse (10/1000µs): 28A (8/20µs); Power - Peak Pulse: 500W; Voltage - Clamping (Max) @ Ipp: 14.5V (Typ); Type: Steering (Rail to Rail); Operating Temperature: -40°C ~ 125°C (TJ); Supplier: Digi-Key; Applications: General Purpose; Manufacturer Part Number: NUP4202W1T2G; Packaging: Cut Tape (CT); Package / Case: 6-TSSOP, SC-88, SOT-363; Mounting Type: Surface Mount; RoHS: RoHS Compliant; Category: Circuit Protection; Supplier Device Package: SC-88/SC70-6/SOT-363; Part Status: Active; ComponentLink1URL: http://www.onsemi.com/pub_link/Collateral/NUP4202W1-D.PDF; ComponentLink1Description: http://www.onsemi.com/pub_link/Collateral/NUP4202W1-D.PDF; Pricing: 1=0.69, 10=0.595, 100=0.4441, 500=0.34896, 1000=0.26965 (USD); Stock: 8683; Supplier Part Number: NUP4202W1T2GOSCT-ND
U4 = LD1117S33TR: STMICROELECTRONICS - LD1117S33CTR - IC, V REG, LDO 3.3V, SMD; No. of Outputs: 1; Input Voltage Max: 15; Output Type: Fixed; Voltage Regulator Type: 3-Terminal Fixed Positive<!--FANDB--><div class="features-and-benefits-container"><div class="features-and-benefits-description"><span class="features-benefits-value">The LD1117S33CTR is a low drop voltage regulator able to provide up to 800mA of output current, available even in adjustable version (VREF = 1.25V). The LD1117S33CTR offers an output voltage of 3.3V. The LD1117S33CTR optimises the thermal characteristics even offering a relevant space saving effect. High efficiency is assured by NPN pass transistor. In fact in this case, the quiescent current flows mostly into the load. Only a very common 10?F minimum capacitor is needed for stability. On chip trimming allows the regulator to reach a very tight output voltage tolerance, within ± 1 % at 25; Output Voltage Nom.: 3.3; Output Current Max: 0.8; Product Range: 3.3V 950; Input Voltage Min: 5.3; Dropout Voltage Vdo: 1.1; Output Current: 950; Accuracy %: 1%; Base Number: 1117; SVHC: No SVHC (17-Dec-2015); LDO Regulator Case Style: SOT-223; No. of Pins: 4; Operating Temperature Min: -40; Operating Temperature Max: 125; Packaging: Cut Tape; Operating Temperature Range: -40°C to +125; Termination Type: Surface Mount Device; Adjustable Output Voltage Min: -; Manufacturer: STMICROELECTRONICS; Supply Voltage Max: 15; Fixed Output Voltage Nom.: 3.3; RoHS: YES; Primary Input Voltage: 5.3; Supplier: Farnell; Manufacturer Part Number: LD1117S33CTR; MSL: MSL 1 - Unlimited; Adjustable Output Voltage Max: -; Automotive Qualification Standard: -; ComponentLink1URL: http://www.farnell.com/datasheets/1776449.pdf; ComponentLink1Description: http://www.farnell.com/datasheets/1776449.pdf; ComponentLink2URL: http://www.farnell.com/cad/1724369.zip; ComponentLink2Description: http://www.farnell.com/cad/1724369.zip; ComponentLink3URL: http://www.farnell.com/datasheets/2158622.pdf; ComponentLink3Description: http://www.farnell.com/datasheets/2158622.pdf; Pricing: 5=0.282, 50=0.157, 250=0.152, 500=0.145, 1000=0.127 (GBP); Supplier Part Number: 1467779
U5 = SN65HVD1050DR: High-Speed CAN Transceiver with Silent Mode 8-SOIC -40 to 125; MF: Texas Instruments; Min Supply Voltage: 4.75V; Max Supply Voltage: 5.25V; Data Rate: 1Mbps; Number of Transceivers: 1; Operating Supply Voltage: 5V; Nominal Supply Current: 70mA; Purchase-URL: https://pricing.snapeda.com/search/part/SN65HVD1050DR/?ref=eda; Digi-Key_Part_Number: 296-26335-1-ND; MP: SN65HVD1050DR; Check_prices: https://www.snapeda.com/parts/SN65HVD1050DR/Texas%20Instruments/view-part/1043210/?ref=eda; SnapEDA_Link: https://www.snapeda.com/parts/SN65HVD1050DR/Texas%20Instruments/view-part/1043210/?ref=snap; Value: *; Package: SOIC-8 Texas Instruments; Supplier 1: Digi-Key; Manufacturer: Texas Instruments; Manufacturer Part Number: SN65HVD1050DR; RoHS: Yes; Category: Interface ICs; Pricing 1: 1=1,69000, 10=1,51300, 25=1,43640, 100=1,18000, 250=1,10304, 500=0,97478, 1000=0,84700 (USD); Case/Package: D; Number of Pins: 8; Weight: 0.002677oz; Contact Plating: Gold; Min Operating Temperature: -40°C; Max Operating Temperature: 125°C; Packaging: Tape and Reel; Package Quantity: 2500; Max Supply Current: 70mA; Number of Drivers: 1; Number of Receivers: 1; Series: -; Supply Current: 70mA; Number of Transmit Buffers: 1; Number of Receive Buffers: 1; Radiation Hardening: No; Lead Free: Lead Free; RoHS Compliant: Yes; REACH SVHC: No SVHC; ComponentLink1URL: https://datasheet.ciiva.com/26828/sn65hvd1050dr-26828644.pdf?src-supplier=IIIC; ComponentLink1Description: https://datasheet.ciiva.com/26828/sn65hvd1050dr-26828644.pdf?src-supplier=IIIC; ComponentLink2URL: https://datasheet.ciiva.com/46392/1888948-46392549.pdf?src-supplier=Element14; ComponentLink2Description: https://datasheet.ciiva.com/46392/1888948-46392549.pdf?src-supplier=Element14; ComponentLink3URL: https://datasheet.ciiva.com/1701/sn65hvd1050-1701693.pdf?src-supplier=Digi-Key; ComponentLink3Description: https://datasheet.ciiva.com/1701/sn65hvd1050-1701693.pdf?src-supplier=Digi-Key; ComponentLink4URL: https://datasheet.ciiva.com/1701/sn65hvd1050-1701694.pdf?src-supplier=Digi-Key; ComponentLink4Description: https://datasheet.ciiva.com/1701/sn65hvd1050-1701694.pdf?src-supplier=Digi-Key; ComponentLink5URL: https://datasheet.ciiva.com/1701/sn65hvd1050-1701695.pdf?src-supplier=Digi-Key; ComponentLink5Description: https://datasheet.ciiva.com/1701/sn65hvd1050-1701695.pdf?src-supplier=Digi-Key; Supplier Part Number 1: 296-26335-6-ND
U6 = USBLC6-2SC6: TVS DIODE 5.25V 17V SOT23-6; Manufacturer: STMicroelectronics; Voltage - Breakdown (Min): 6V; Current - Peak Pulse (10/1000µs): 5A (8/20µs); Power Line Protection: Yes; Voltage - Reverse Standoff (Typ): 5.25V; Type: Steering (Rail to Rail); Part Status: Active; Supplier: Digi-Key; Packaging: Tape & Reel (TR); Category: Circuit Protection; RoHS: RoHS Compliant; Manufacturer Part Number: USBLC6-2SC6; Mounting Type: Surface Mount; Applications: Ethernet; Operating Temperature: -40°C ~ 125°C (TJ); Capacitance @ Frequency: -; Package / Case: SOT-23-6; Power - Peak Pulse: -; Voltage - Clamping (Max) @ Ipp: 17V; Supplier Device Package: SOT-23-6; Base Part Number: USBLC6-2; ComponentLink1URL: http://www.st.com/content/ccc/resource/technical/document/datasheet/06/1d/48/9c/6c/20/4a/b2/CD00050750.pdf/files/CD00050750.pdf/jcr:content/translations/en.CD00050750.pdf; ComponentLink1Description: http://www.st.com/content/ccc/resource/technical/document/datasheet/06/1d/48/9c/6c/20/4a/b2/CD00050750.pdf/files/CD00050750.pdf/jcr:content/translations/en.CD00050750.pdf; Pricing: 3000=0.16828, 6000=0.15743, 15000=0.14657, 30000=0.14476 (USD); Supplier Part Number: 497-5235-2-ND
X1 = CRYSTAL__7M-16.000MAAJ-T: Crystal 16MHz ±30ppm (Tol) ±30ppm (Stability) 18pF FUND 100Ohm 4-Pin SMD T/R; Manufacturer: TXC; ESR (Equivalent Series Resistance): 100R; Supplier 1: Digi-Key; Manufacturer Part Number: 7M-16.000MAAJ-T; RoHS: Yes; Category: Crystals; Pricing 1: 1=0,91000, 10=0,80500, 50=0,75240, 100=0,66500, 500=0,63000, 1000=0,52500 (USD); Mount: Surface Mount; Case/Package: SMD/SMT; Number of Pins: 4; Min Operating Temperature: -10°C; Max Operating Temperature: 70°C; Frequency Tolerance: 30ppm; Load Capacitance: 18pF; Package Quantity: 3000; Tolerance: 30ppm; Packaging: Tape and Reel; Frequency Stability: 30ppm; Termination: SMD/SMT; Series: 7M; Length: 3.2mm; Width: 2.5mm; Height: 0.031inch; Depth: 2.5mm; REACH SVHC: No SVHC; RoHS Compliant: Yes; ComponentLink1URL: https://datasheet.ciiva.com/22698/1796637-22698757.pdf?src-supplier=Element14; ComponentLink1Description: https://datasheet.ciiva.com/22698/1796637-22698757.pdf?src-supplier=Element14; ComponentLink2URL: https://datasheet.ciiva.com/46431/1796637-46431980.pdf?src-supplier=Element14; ComponentLink2Description: https://datasheet.ciiva.com/46431/1796637-46431980.pdf?src-supplier=Element14; ComponentLink3URL: https://datasheet.ciiva.com/1356/number-crystal-basic-1356577.pdf?src-supplier=Element14; ComponentLink3Description: https://datasheet.ciiva.com/1356/number-crystal-basic-1356577.pdf?src-supplier=Element14; ComponentLink4URL: https://datasheet.ciiva.com/855/7m-855384.pdf?src-supplier=Digi-Key; ComponentLink4Description: https://datasheet.ciiva.com/855/7m-855384.pdf?src-supplier=Digi-Key; ComponentLink5URL: https://datasheet.ciiva.com/855/7m-855385.pdf?src-supplier=Digi-Key; ComponentLink5Description: https://datasheet.ciiva.com/855/7m-855385.pdf?src-supplier=Digi-Key; ComponentLink6URL: https://datasheet.ciiva.com/855/7m-855386.pdf?src-supplier=Digi-Key; ComponentLink6Description: https://datasheet.ciiva.com/855/7m-855386.pdf?src-supplier=Digi-Key; Supplier Part Number 1: 887-1125-6-ND